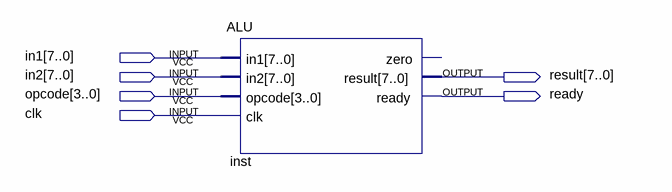
[diagram p0: schematic sheet]
// Quartus schematic ALUtest.bdf as structural Verilog: 1 symbols, 6 pins
module ALUtest (
  input  [7:0] in1,
  input  [7:0] in2,
  input  [3:0] opcode,
  input  clk,
  output [7:0] result,
  output ready
);

  ALU inst (.in1(in1), .in2(in2), .opcode(opcode), .clk(clk), .result(result), .ready(ready));  // open: zero
endmodule
